# Altium schematic sheet Card Edge Connector.SchDoc: Card Edge Connector
size 292 x 193 mm; SheetNumber: 2; SheetTotal: 11
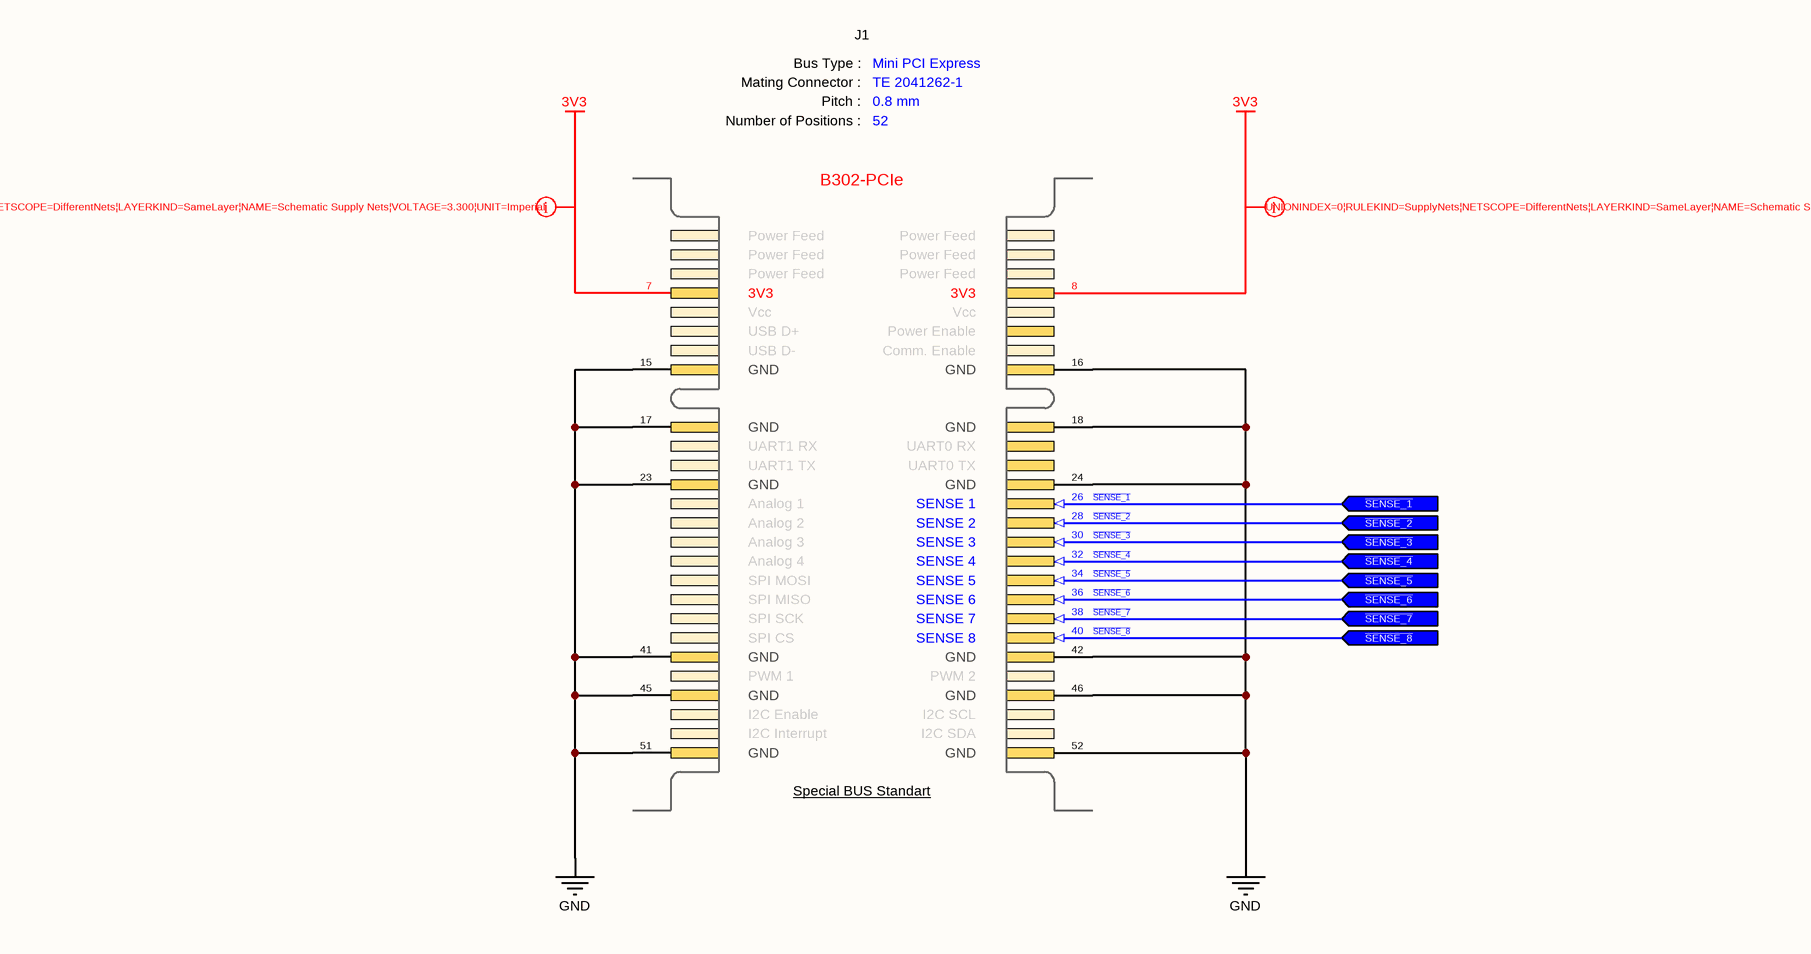
[diagram p0: Card Edge Connector.SchDoc]

## Parts
J1  BUS Type: Mini PCI Express  Mating Connector: TE 2041262-1  Pitch: 0.8 mm  Number of Positions: 52  [PCB - Mini PCI Express]  (hidden comment: Connector - Mini PCI-E (Male B302-PCIe))  (no BOM)

## Ports
~{SENSE_1} (in), ~{SENSE_2} (in), ~{SENSE_3} (in), ~{SENSE_4} (in), ~{SENSE_5} (in), ~{SENSE_6} (in), ~{SENSE_7} (in), ~{SENSE_8} (in)

## Nets
3V3: J1.7(Pin-7) J1.8(Pin-8)
GND: J1.15(Pin-15) J1.16(Pin-16) J1.17(Pin-17) J1.18(Pin-18) J1.23(Pin-23) J1.24(Pin-24) J1.41(Pin-41) J1.42(Pin-42) J1.45(Pin-45) J1.46(Pin-46) J1.51(Pin-51) J1.52(Pin-52)
~{SENSE_1}: J1.26(Pin-26) ; port ~{SENSE_1}
~{SENSE_2}: J1.28(Pin-28) ; port ~{SENSE_2}
~{SENSE_3}: J1.30(Pin-30) ; port ~{SENSE_3}
~{SENSE_4}: J1.32(Pin-32) ; port ~{SENSE_4}
~{SENSE_5}: J1.34(Pin-34) ; port ~{SENSE_5}
~{SENSE_6}: J1.36(Pin-36) ; port ~{SENSE_6}
~{SENSE_7}: J1.38(Pin-38) ; port ~{SENSE_7}
~{SENSE_8}: J1.40(Pin-40) ; port ~{SENSE_8}

## Layout directives
rule Supply Nets [Voltage = 3.300]: 3V3

## Notes on the sheet
- © 2021 All rights reserved.
  This document may not, in whole or in part, be copied, photocopied, reproduced, translated or converted to any electronic or machine readable from without prior written permission of Mehmet Günce Akkoyun.
  Engineer contact : akkoyun@me.com
- Property of
- Engineer :
- Date :
- Size :
- A4
- Time :
- Project :
- Page :
- /
- Customer :
- Product ID :
- Module ID :
- Version :
- File :
- Revision :
- (in symbol Connector - Mini PCI-E (Male B302-PCIe)) Bus Type :; Mating Connector :; Pitch :; Number of Positions :; B302-PCIe; Power Feed; 3V3; Vcc; USB D+; Power Enable; USB D-; Comm. Enable; GND; UART1 RX; UART0 RX; UART1 TX; UART0 TX; Analog 1; SENSE 1; Analog 2; SENSE 2; Analog 3; SENSE 3; Analog 4; SENSE 4; SPI MOSI; SENSE 5; SPI MISO; SENSE 6; SPI SCK; SENSE 7; SPI CS; SENSE 8; PWM 1; PWM 2; I2C Enable; I2C SCL; I2C Interrupt; I2C SDA; Special BUS Standart

## Library data of the parts
J1 = Connector - Mini PCI-E (Male B302-PCIe): Mini PCI-Express gold finger connector.; System: Connector